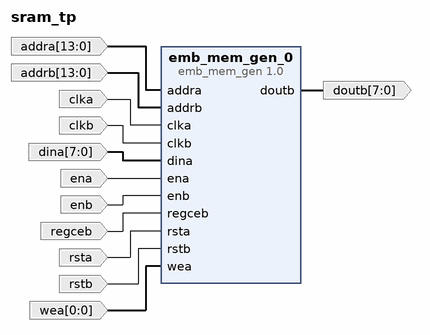
[diagram p0: block diagram of the top level]
# Vivado block design sram_tp, xcvh1582-vsva3697-2MP-e-S, Vivado 2024.2
create_bd_design sram_tp

create_bd_port -dir I -type rst rstb
create_bd_port -dir I -from 13 -to 0 addra
create_bd_port -dir I -from 0 -to 0 wea
create_bd_port -dir I -type rst rsta
create_bd_port -dir I ena
create_bd_port -dir I enb
create_bd_port -dir O -from 7 -to 0 doutb
create_bd_port -dir I -type clk clkb
create_bd_port -dir I -from 13 -to 0 addrb
create_bd_port -dir I -from 7 -to 0 dina
create_bd_port -dir I -type clk clka
create_bd_port -dir I regceb

create_bd_cell -type ip -vlnv xilinx.com:ip:emb_mem_gen:1.0 emb_mem_gen_0
set_property -dict [list \
  CONFIG.MEMORY_DEPTH 16384 \
  CONFIG.MEMORY_TYPE Simple_Dual_Port_RAM \
  CONFIG.READ_LATENCY_B 1 \
  CONFIG.USE_MEMORY_BLOCK Stand_Alone \
  CONFIG.WRITE_DATA_WIDTH_A 8 \
  CONFIG.WRITE_MODE_A WRITE_FIRST \
] [get_bd_cells emb_mem_gen_0]

# ---- connections ----

connect_bd_net -net addra_0_1 [get_bd_ports addra] [get_bd_pins emb_mem_gen_0/addra]
connect_bd_net -net addrb_0_1 [get_bd_ports addrb] [get_bd_pins emb_mem_gen_0/addrb]
connect_bd_net -net clka_0_1 [get_bd_ports clka] [get_bd_pins emb_mem_gen_0/clka]
connect_bd_net -net clkb_0_1 [get_bd_ports clkb] [get_bd_pins emb_mem_gen_0/clkb]
connect_bd_net -net dina_0_1 [get_bd_ports dina] [get_bd_pins emb_mem_gen_0/dina]
connect_bd_net [get_bd_pins emb_mem_gen_0/doutb] [get_bd_ports doutb]
connect_bd_net -net ena_0_1 [get_bd_ports ena] [get_bd_pins emb_mem_gen_0/ena]
connect_bd_net -net enb_0_1 [get_bd_ports enb] [get_bd_pins emb_mem_gen_0/enb]
connect_bd_net -net regceb_0_1 [get_bd_ports regceb] [get_bd_pins emb_mem_gen_0/regceb]
connect_bd_net -net rsta_0_1 [get_bd_ports rsta] [get_bd_pins emb_mem_gen_0/rsta]
connect_bd_net -net rstb_0_1 [get_bd_ports rstb] [get_bd_pins emb_mem_gen_0/rstb]
connect_bd_net -net wea_0_1 [get_bd_ports wea] [get_bd_pins emb_mem_gen_0/wea]

validate_bd_design
save_bd_design
